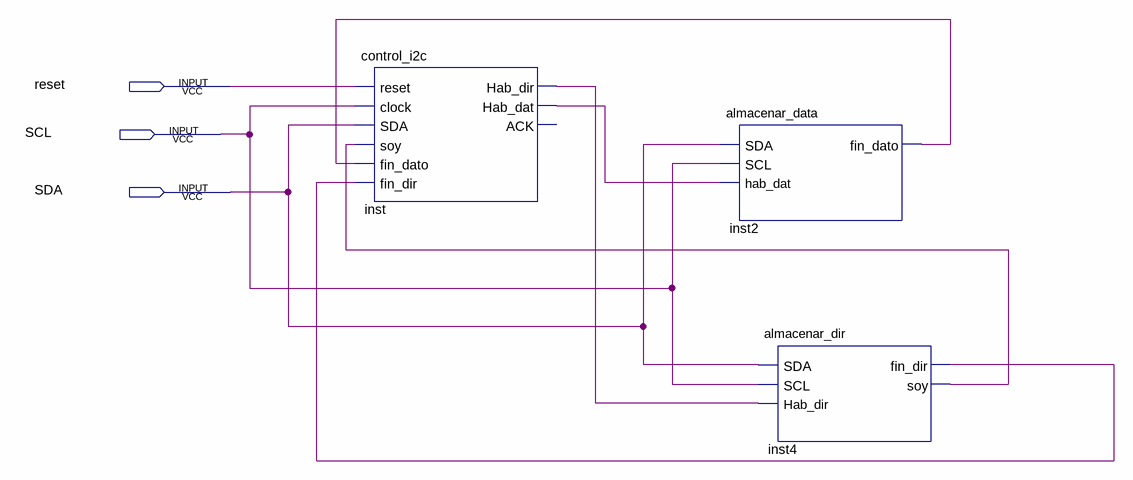
[diagram p0: schematic sheet]
// Quartus schematic control_esclavo.bdf as structural Verilog: 3 symbols, 3 pins
module control_esclavo (
  input  reset,
  input  SCL,
  input  SDA
);

  wire inst2_fin_dato, inst4_fin_dir, inst4_soy, inst_hab_dat, inst_hab_dir;

  control_i2c inst (
    .reset(reset), .clock(SCL), .SDA(SDA), .soy(inst4_soy), .fin_dato(inst2_fin_dato),
    .fin_dir(inst4_fin_dir), .Hab_dir(inst_hab_dir), .Hab_dat(inst_hab_dat));  // open: ACK
  almacenar_data inst2 (.SDA(SDA), .SCL(SCL), .hab_dat(inst_hab_dat), .fin_dato(inst2_fin_dato));
  almacenar_dir inst4 (.SDA(SDA), .SCL(SCL), .Hab_dir(inst_hab_dir), .fin_dir(inst4_fin_dir), .soy(inst4_soy));
endmodule
